# EAGLE design pcb_aux_motors (EAGLE 7.2.0)
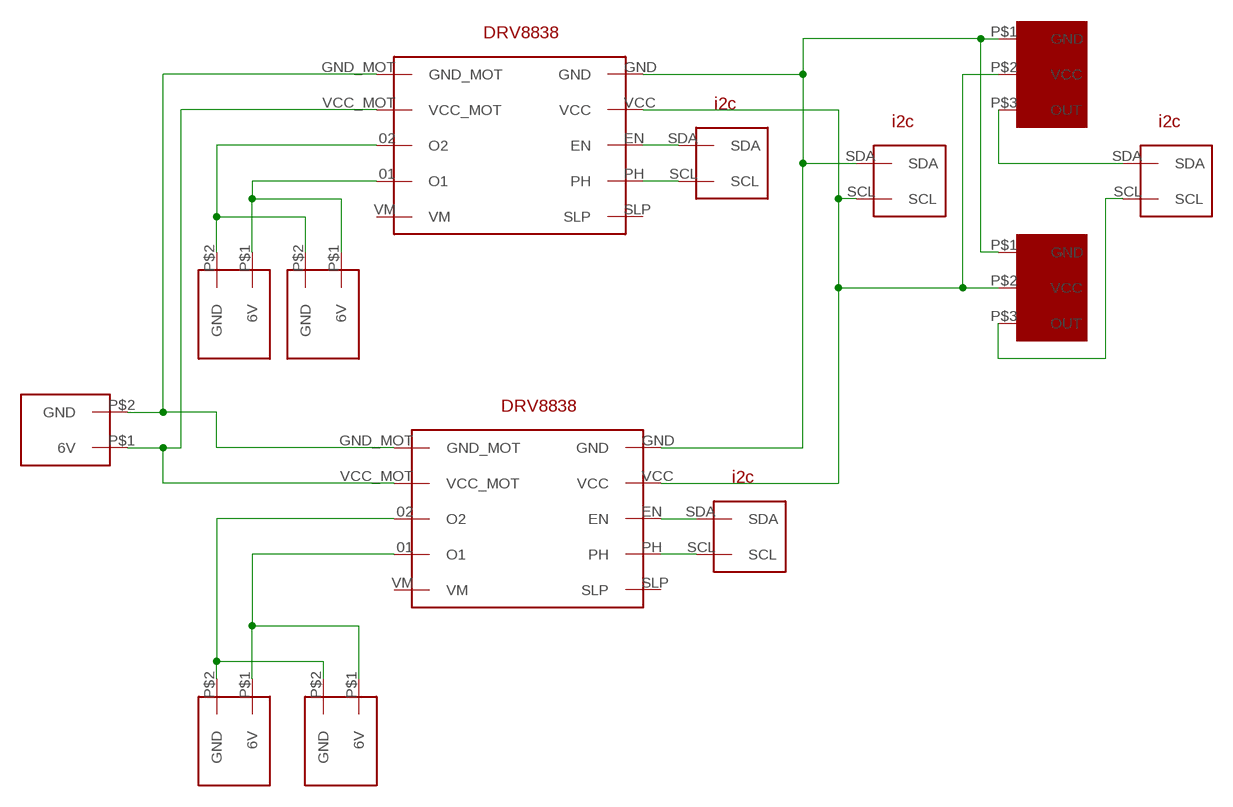
[diagram p0: schematic, sheet 1]

## Parts
EN/PH1  I2C  [I2C]
EN/PH2  I2C  [I2C]
ENCODERS  I2C  [I2C]
U$1  MOTOR  [MOTOR]
U$2  ENCODER  [ENCODER]
U$3  ENCODER  [ENCODER]
U$4  DRV8838  [DRV8838]
U$8  MOTOR  [MOTOR]
U$9  MOTOR  [MOTOR]
U$10  MOTOR  [MOTOR]
U$11  MOTOR  [MOTOR]
U$12  DRV8838  [DRV8838]
VCC/GND  I2C  [I2C]

## Nets
GND: U$2.P$1(GND) U$3.P$1(GND) U$4.GND U$12.GND VCC/GND.SDA
N$1: ENCODERS.SDA U$2.P$3(OUT)
N$2: ENCODERS.SCL U$3.P$3(OUT)
N$3: U$1.P$2(GND) U$4.02(O2) U$8.P$2(GND)
N$4: U$1.P$1(6V) U$4.01(O1) U$8.P$1(6V)
N$5: U$9.P$2(GND) U$10.P$2(GND) U$12.02(O2)
N$6: U$9.P$1(6V) U$10.P$1(6V) U$12.01(O1)
N$11: U$4.GND_MOT U$11.P$2(GND) U$12.GND_MOT
N$12: U$4.VCC_MOT U$11.P$1(6V) U$12.VCC_MOT
N$22: EN/PH1.SDA U$4.EN
N$23: EN/PH1.SCL U$4.PH
N$24: EN/PH2.SDA U$12.EN
N$25: EN/PH2.SCL U$12.PH
VCC: U$2.P$2(VCC) U$3.P$2(VCC) U$4.VCC U$12.VCC VCC/GND.SCL
Unconnected: U$4.SLP U$4.VM U$12.SLP U$12.VM

## Library data of the parts
EN/PH1 EN/PH2 ENCODERS VCC/GND = perceptrons:I2C
U$1 U$8-U$11 = perceptrons:MOTOR
U$2 U$3 = perceptrons:ENCODER
U$4 U$12 = perceptrons:DRV8838

## Board
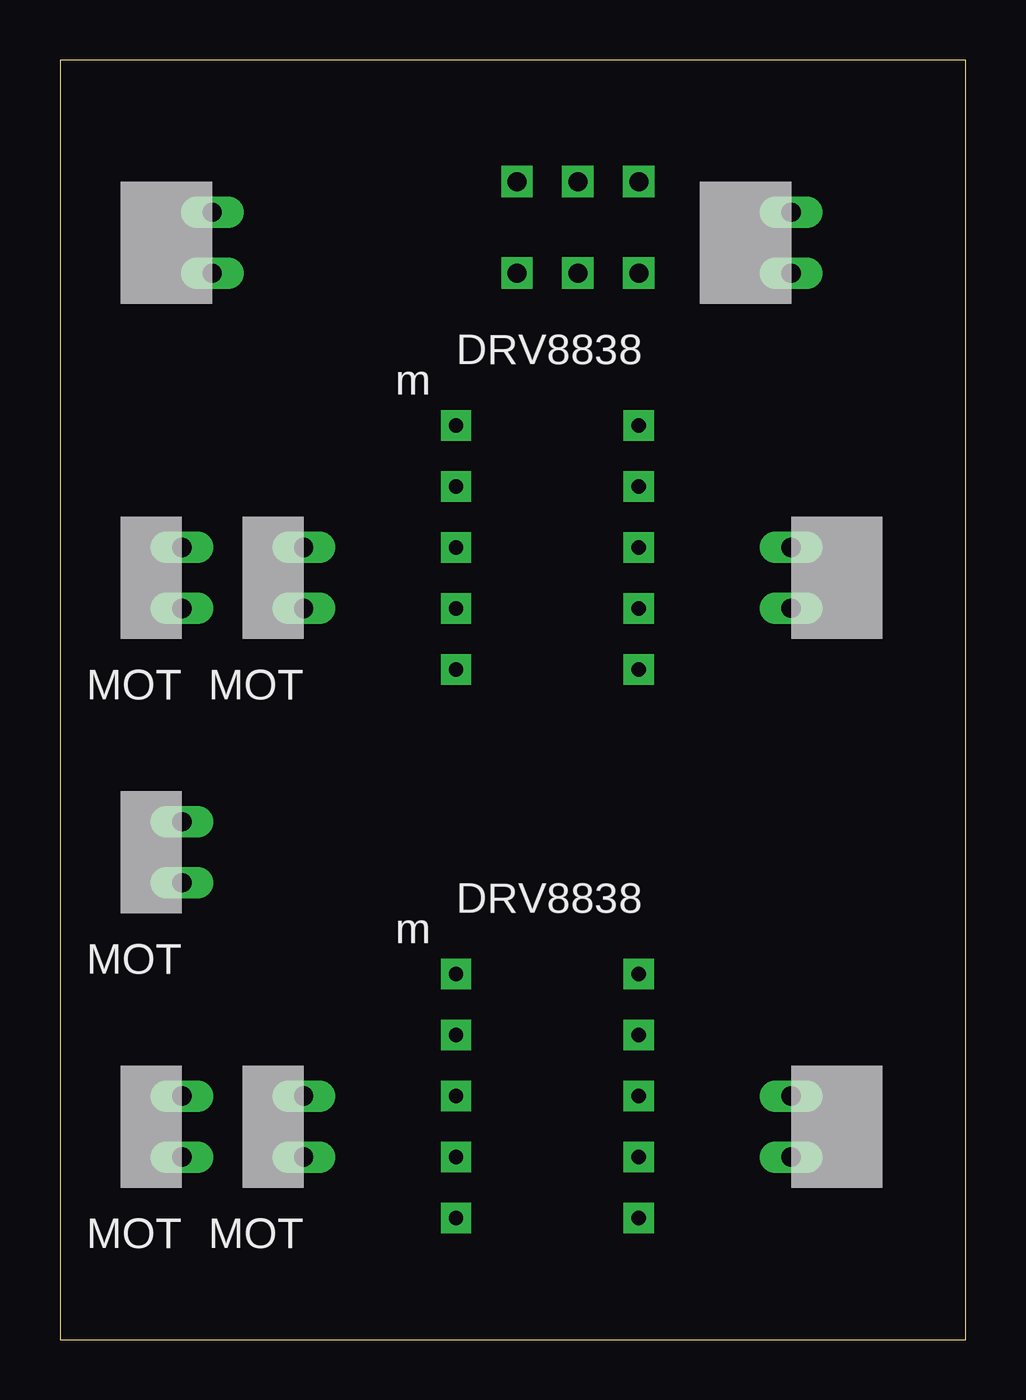
[diagram p1: board, top side]
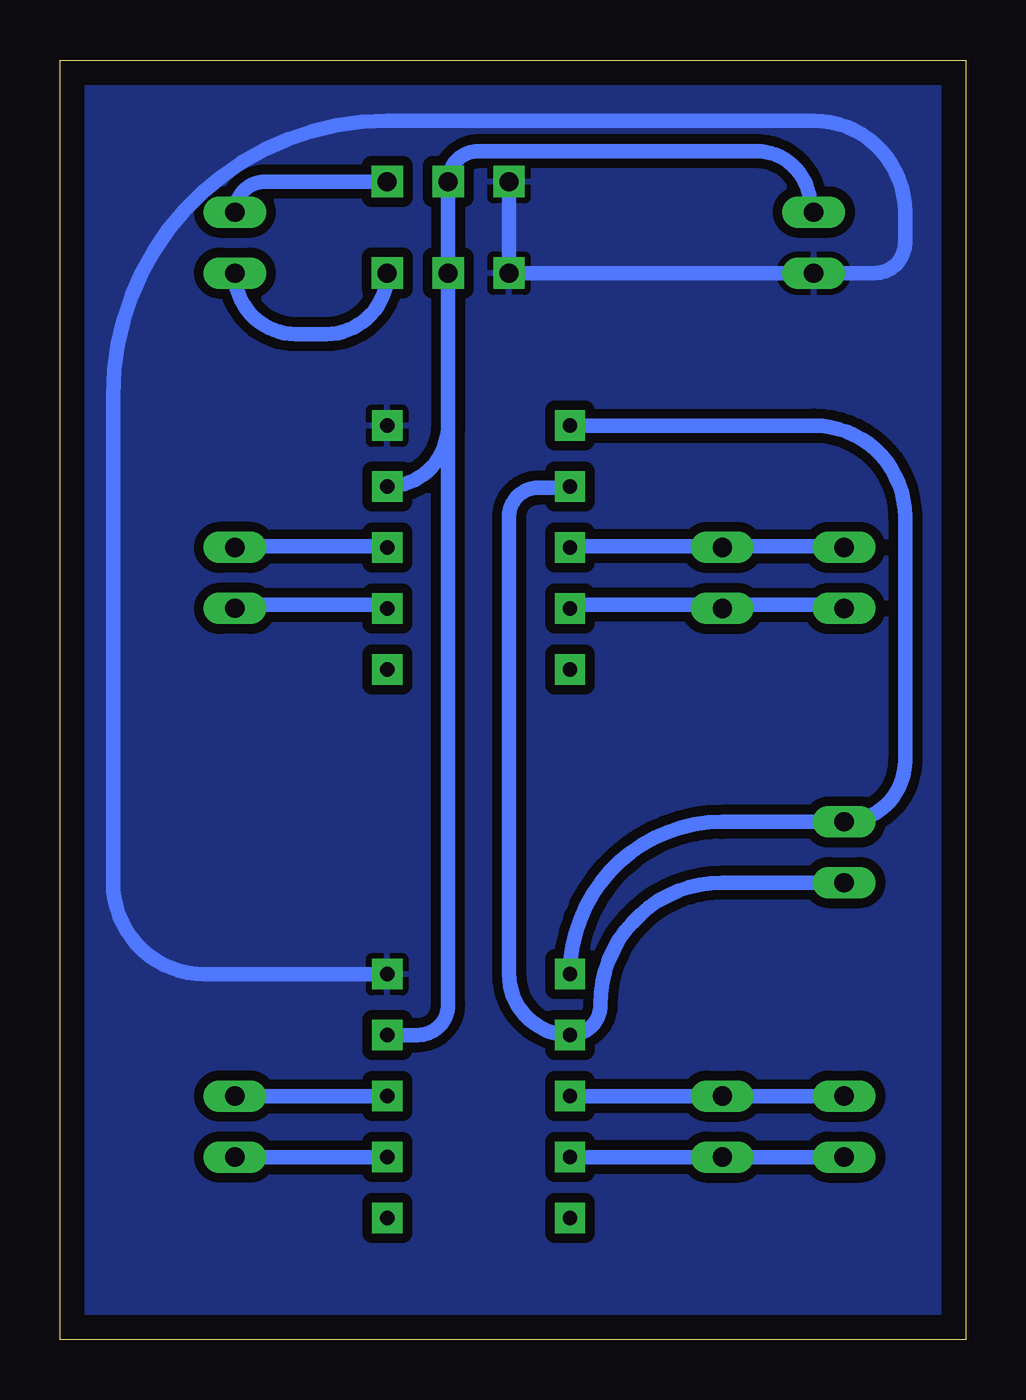
[diagram p2: board, bottom side, seen from below]

Size 37.77 x 53.33 mm. Coordinates in mm from the lower left corner, seen from the top.
Outline: 0,0 37.77,0 37.77,53.33 0,53.33 0,0
Copper layers (1*16): Top 0.035mm / dielectric 1.5mm / Bottom 0.035mm
Design rules "default *": minimum track width 24mil, minimum drill 24mil, track to track 8mil, track to pad 8mil, pad to pad 8mil, via to via 8mil, smd to smd 8mil, copper to edge 40mil, drill to drill 8mil, minimum pad ring 10mil, minimum via ring 8mil, stop-mask expansion 4mil, vias tented up to drill 0mil, thermal gap 10mil

### Footprints (pad centres in the part's own frame; a part is rotated, then mirrored left to right if it is on the bottom)
I2C = drill 0.8 long: SCL -10.16,1.27; SDA -10.16,3.81
MOTOR = drill 0.8 long: P$1 -13.97,5.08; P$2 -13.97,2.54
ENCODER = drill 0.8 square: P$1 -7.62,3.81; P$2 -7.62,1.27; P$3 -7.62,-1.27
DRV8838 = drill 0.6 pad 1.27 square: 01 -6.35,-2.54; 02 -6.35,0; EN 1.27,0; GND 1.27,5.08; GND_MOT -6.35,5.08; PH 1.27,-2.54; SLP 1.27,-5.08; VCC 1.27,2.54; VCC_MOT -6.35,2.54; VM -6.35,-5.08

### Placement (x,y rotation side)
EN/PH1  40.64,6.35 0 top
EN/PH2  40.64,29.21 0 top
ENCODERS  20.32,48.26 180 top
U$1  -8.89,12.7 180 top
U$2  22.86,52.07 90 top
U$3  22.86,55.88 90 top
U$4  22.86,10.16 0 top
U$8  -3.81,12.7 180 top
U$9  -3.81,35.56 180 top
U$10  -8.89,35.56 180 top
U$11  -8.89,24.13 180 top
U$12  22.86,33.02 0 top
VCC/GND  -3.81,48.26 180 top

### Tracks (layer width: path | path; a pad name or v marks a point on that pad's centre or on a via)
GND
  Bottom 0.61: U$4.GND 31.75,15.24 arc90 35.56,19.05 35.56,39.37 arc90 24.13,50.8 6.35,50.8 arc90 2.54,46.99 2.54,45.72 arc90 3.81,44.45 VCC/GND.SDA U$2.P$1 U$3.P$1
  pour Bottom (isolate 0.406): 0,53.34 38.1,53.34 38.1,49.53 38.1,0 0,0
N$1
  Bottom 0.61: U$2.P$3 arc90 26.67,41.91 27.94,41.91 arc90 ENCODERS.SDA
N$2
  Bottom 0.61: U$3.P$3 29.21,48.26 arc-90 ENCODERS.SCL
N$3
  Bottom 0.61: U$4.02 U$8.P$2 U$1.P$2
N$4
  Bottom 0.61: U$4.01 U$8.P$1 U$1.P$1
N$5
  Bottom 0.61: 10.16,33.07 16.26,33.07 U$12.02 | 10.16,33.07 5.28,33.07 U$10.P$2 | 10.16,33.07 U$9.P$2
N$6
  Bottom 0.61: 10.16,30.63 16.26,30.63 U$12.01 | 10.16,30.63 5.28,30.63 U$10.P$1 | 10.16,30.63 U$9.P$1
N$11
  Bottom 0.61: U$4.GND_MOT arc90 10.16,21.59 U$11.P$2 arc-90 2.54,24.13 2.54,34.29 arc-90 6.35,38.1 U$12.GND_MOT
N$12
  Bottom 0.61: U$12.VCC_MOT 16.26,35.51 17.83,35.51 arc-90 19.05,34.29 19.05,15.24 arc-90 U$4.VCC_MOT arc-90 15.24,13.97 arc90 10.16,19.05 U$11.P$1
N$22
  Bottom 0.61: EN/PH1.SDA U$4.EN
N$23
  Bottom 0.61: EN/PH1.SCL U$4.PH
N$24
  Bottom 0.61: U$12.EN 24.38,33.07 30.48,33.07 EN/PH2.SDA
N$25
  Bottom 0.61: U$12.PH 24.38,30.63 30.48,30.63 EN/PH2.SCL
VCC
  Bottom 0.61: VCC/GND.SCL 6.5,47.3 arc-90 8.74,49.53 20.32,49.53 arc-90 U$3.P$2 U$2.P$2 21.59,38.1 | 21.59,38.1 arc90 U$12.VCC | U$4.VCC 22.86,12.7 arc-90 21.59,13.97 21.59,38.1